# EAGLE design Add-OnV20-final (EAGLE 6.3)
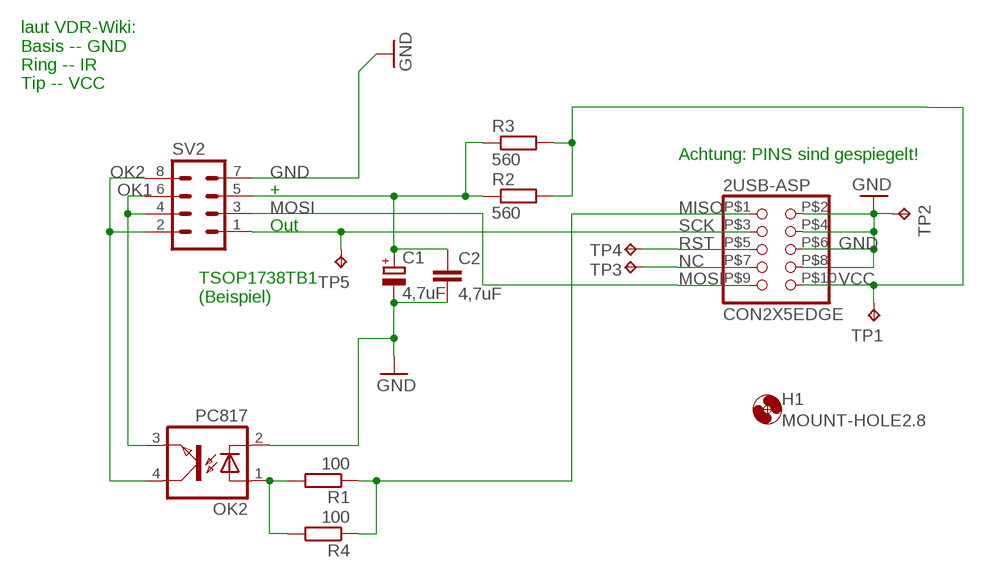
[diagram p0: schematic, sheet 1]

## Parts
2USB-ASP  CON2X5EDGE  [CON2X5EDGE]
C1  4,7uF  CPOL-EUE1.8-4  [E1,8-4]
C2  4,7uF  C-EUC1206K  [C1206K]
H1  MOUNT-HOLE2.8  [2,8]
OK2  PC817  [DIL04]
R1  100  R-EU_0204/7  [0204/7]
R2  560  R-EU_0204/7  [0204/7]
R3  560  R-EU_R0805W  [R0805W]
R4  100  R-EU_R0805W  [R0805W]
SV2  MA04-2  [MA04-2]
TP1  TPB1,27  [B1,27]
TP2  TPB1,27  [B1,27]
TP3  TPB1,27  [B1,27]
TP4  TPB1,27  [B1,27]
TP5  TPB1,27  [B1,27]

## Nets
GND: 2USB-ASP.P$2 2USB-ASP.P$4 2USB-ASP.P$6 2USB-ASP.P$8 C1.- C2.2 OK2.2(C) SV2.7 TP2.TP
MISO: 2USB-ASP.P$1 R1.1 R4.1
MOSI: 2USB-ASP.P$9 SV2.3
N$1: C1.+ C2.1 R2.1 R3.1 SV2.5
N$2: OK2.1(A) R1.2 R4.2
NC: 2USB-ASP.P$7 TP3.TP
OK1: OK2.3(EMIT) SV2.4 SV2.6
OK2: OK2.4(COL) SV2.2 SV2.8
RST: 2USB-ASP.P$5 TP4.TP
SCK: 2USB-ASP.P$3 SV2.1 TP5.TP
VCC: 2USB-ASP.P$10 R2.2 R3.2 TP1.TP

## Notes on the sheet
- laut VDR-Wiki:
  Basis -- GND
  Ring -- IR
  Tip -- VCC
- Achtung: PINS sind gespiegelt!
- +
- Out
- TSOP1738TB1
  (Beispiel)

## Library data of the parts
2USB-ASP = schwen:CON2X5EDGE
C1 = rcl:CPOL-EU: POLARIZED CAPACITOR, European symbol
C2 = rcl:C-EU: CAPACITOR, European symbol
H1 = holes:MOUNT-HOLE: MOUNTING HOLE with drill center marker
OK2 = optocoupler:PC817: SHARP OPTO COUPLER; MPN: PC817X4J000F; OC_FARNELL: 9707727; OC_NEWARK: 97K7059
R1-R4 = rcl:R-EU_: RESISTOR, European symbol
SV2 = con-lstb:MA04-2: PIN HEADER; OC_FARNELL: unknown; OC_NEWARK: unknown
TP1-TP5 = testpad:TP: Test pad

## Net classes
0 default: width 0.406 mm

## Board
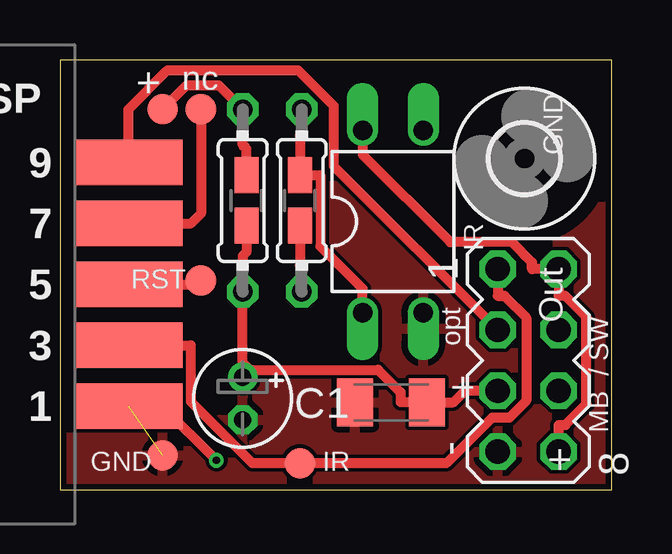
[diagram p1: board, top side]
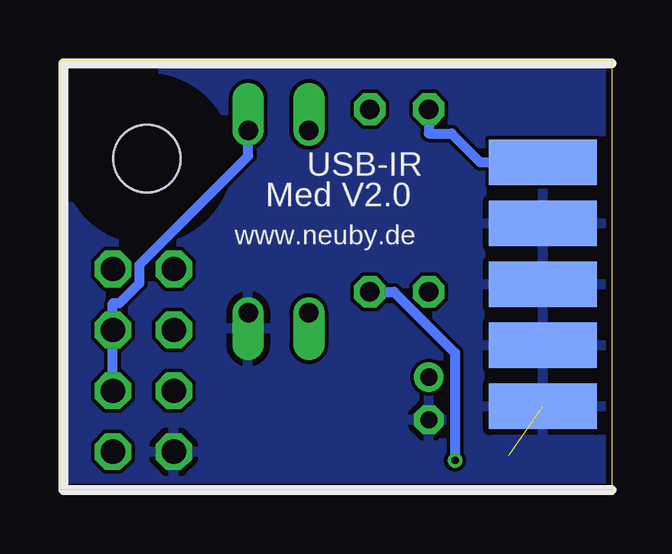
[diagram p2: board, bottom side, seen from below]

Size 23 x 17.93 mm. Coordinates in mm from the lower left corner, seen from the top.
Outline: 0,0 23,0 23,17.93 0,17.93 0,0
Copper layers (1*16): Top 0.035mm / dielectric 1.5mm / Bottom 0.035mm
Design rules "Fusion_eagle_rule_v1.1": minimum track width 6mil, minimum drill 12mil, track to track 6mil, track to pad 6mil, pad to pad 6mil, via to via 6mil, smd to smd 0mil, copper to edge 10mil, drill to drill 10mil, minimum pad ring 10mil, minimum via ring 6mil, stop-mask expansion 2mil, vias tented up to drill 100mil, thermal gap 10mil

### Footprints (pad centres in the part's own frame; a part is rotated, then mirrored left to right if it is on the bottom)
CON2X5EDGE = smd 4.5 x 1.9: P$1 0,5.08; P$3 0,2.54; P$5 0,0; P$7 0,-2.54; P$9 0,-5.08 | smd 4.5 x 1.9 bottom: P$2 0,5.08; P$4 0,2.54; P$6 0,0; P$8 0,-2.54; P$10 0,-5.08
E1,8-4 = drill 0.711 pad 1.168: + -0.889,0 | drill 0.711 pad 1.168 octagon: - 0.889,0
C1206K = smd 1.5 x 2: 1 -1.5,0; 2 1.5,0
2,8 = hole 2.8: 0,0
DIL04 = drill 0.813 offset: 1 -1.27,-3.81; 2 1.27,-3.81; 3 1.27,3.81; 4 -1.27,3.81
0204/7 = drill 0.813 octagon: 1 -3.81,0; 2 3.81,0
R0805W = smd 1.5 x 1: 1 -1.052,0; 2 1.052,0
MA04-2 = drill 1.016 octagon: 1 -3.81,-1.27; 2 -3.81,1.27; 3 -1.27,-1.27; 4 -1.27,1.27; 5 1.27,-1.27; 6 1.27,1.27; 7 3.81,-1.27; 8 3.81,1.27
B1,27 = smd 1.27 x 1.27: TP 0,0

### Placement (x,y rotation side)
2USB-ASP  2.86,8.57 180 top
C1  7.62,3.81 270 top
C2  13.81,3.65 180 top
H1  19.37,13.81 0 top
OK2  13.88,11.19 0 top
R1  10.08,12.06 90 top
R2  7.62,12.06 90 top
R3  7.78,12.06 90 top
R4  10,12.06 90 top
SV2  19.53,5.4 270 top
TP1  4.29,15.88 0 top
TP2  4.29,1.43 0 top
TP3  5.88,15.88 0 top
TP4  5.88,8.73 0 top
TP5  10,1.11 0 top

### Tracks (layer width: path | path; a pad name or v marks a point on that pad's centre or on a via)
GND  (1 unrouted)
  pour Bottom: 0,17.78 0,0 22.86,0 22.86,17.78
  pour Top: 0,17.78 22.86,17.78 22.86,0 0,0
MISO  (via drill 0.3 pad 0.61)
  Top 0.406: v6.52,1.23 4.26,3.49 2USB-ASP.P$1 | R1.1 10.08,9.27 10,9.35 R4.1
  Bottom 0.406: R1.1 9.06,8.26 6.52,5.71 v6.52,1.23
MOSI
  Top 0.406: 2USB-ASP.P$9 2.86,15.87 4.48,17.49 9.94,17.49 11.41,16.01 11.41,13.51 SV2.3
N$1
  Top 0.406: 7.93,5.01 13.26,5.01 14.2,4.07 14.2,3.65 C2.1 16.42,3.65 16.89,4.13 SV2.5 | C1.+ 7.93,5.01 | 7.93,5.01 7.62,5.31 R2.1 7.62,9.75 7.78,9.91 R3.1
N$2
  Top 0.406: R1.2 10.08,14.86 10,14.78 R4.2 10.86,13.12 10.86,10.15 12.62,8.4 OK2.1
NC
  Top 0.406: 2USB-ASP.P$7 5.47,11.11 5.88,11.52 TP3.TP
OK1
  Bottom 0.406: OK2.3 15.15,13.92 19.68,9.39 19.68,8.62 20.52,7.79 20.8,7.79 SV2.4 SV2.6
OK2
  Top 0.406: SV2.8 20.8,2.71 21.08,2.71 21.95,3.58 21.95,7.21 21.07,8.09 20.8,8.09 SV2.2 19.68,9.21 19.68,9.49 18.84,10.33 16.27,10.33 12.62,13.98 OK2.4
RST
  Top 0.406: 2USB-ASP.P$5 5.47,8.57 5.63,8.73 TP4.TP
SCK
  Top 0.406: 2USB-ASP.P$3 5.47,6.03 5.47,3.67 8.02,1.11 TP5.TP 16.11,1.11 18.01,3.01 18.74,3.01 19.44,3.71 19.44,7.18 18.54,8.09 18.26,8.09 SV2.1
VCC
  Top 0.406: R3.2 7.78,14.22 7.62,14.38 R2.2 6.62,16.87 5.28,16.87 TP1.TP
  Bottom 0.406: R2.2 7.62,14.86 6.67,14.86 5.47,13.65 2USB-ASP.P$10

### Text on the board
bOrigins: + | + | IR | SW | GND | + | MB | GND
tNames: + | nc | GND | IR | RST | opt | Out | + | MB / SW | - | GND | IR | +
bNames: USB-IR | Med V2.0 | www.neuby.de
bValues: 560R | 100R